# EAGLE design gateway (EAGLE 9.6.2)
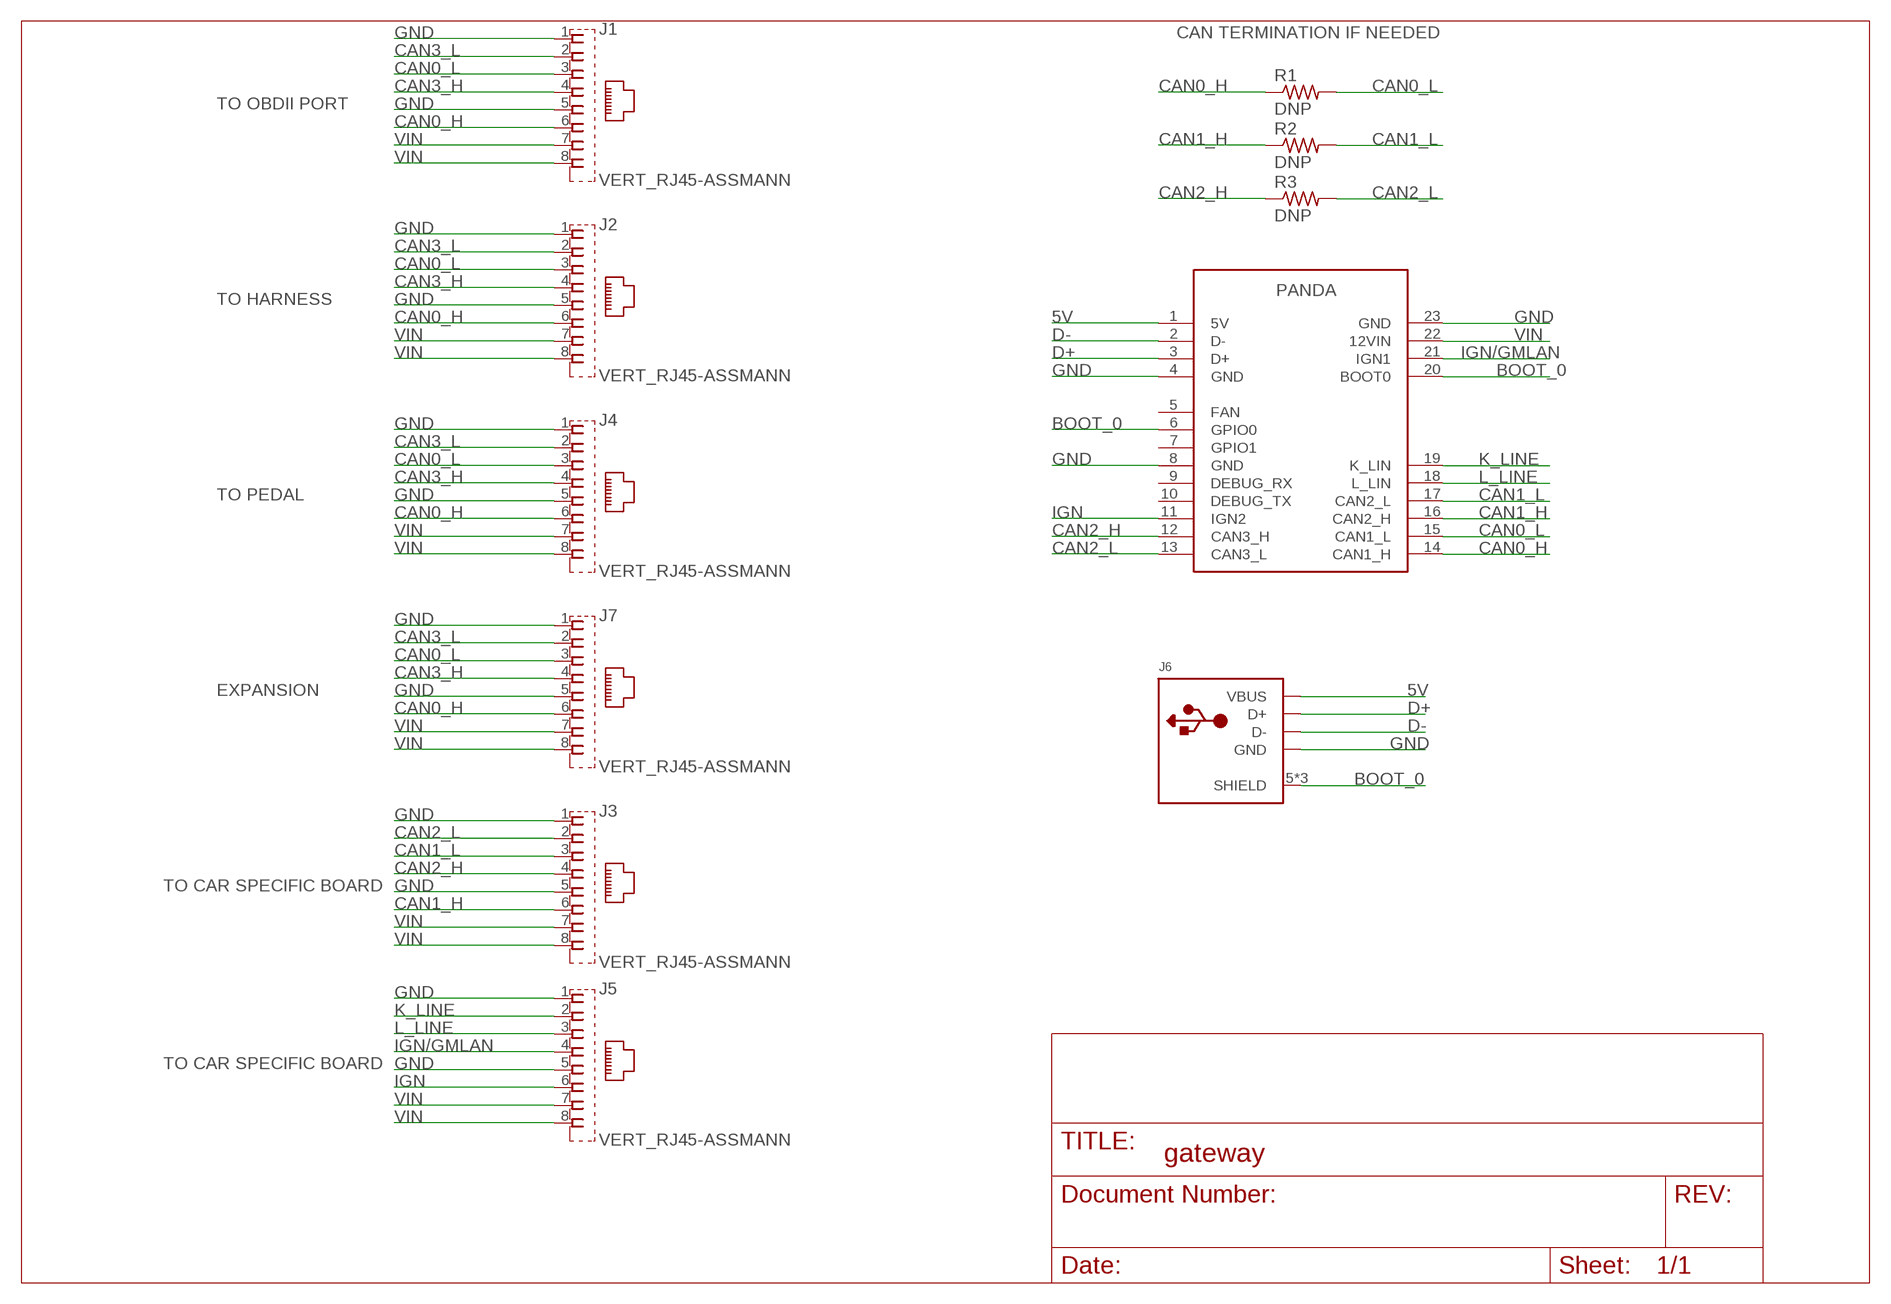
[diagram p0: schematic, sheet 1]

## Parts
J1  VERT_RJ45-ASSMANN  [RJ45-VERT]
J2  VERT_RJ45-ASSMANN  [RJ45-VERT]
J3  VERT_RJ45-ASSMANN  [RJ45-VERT]
J4  VERT_RJ45-ASSMANN  [RJ45-VERT]
J5  VERT_RJ45-ASSMANN  [RJ45-VERT]
J6  USB-AMOLEX  [USB-A-VERT-MOLEX]
J7  VERT_RJ45-ASSMANN  [RJ45-VERT]
R1  DNP  R0603  [0603-R]
R2  DNP  R0603  [0603-R]
R3  DNP  R0603  [0603-R]
U$1  PANDA  [PANDA-FOOT]

## Nets
5V: J6.1(VBUS) U$1.1(5V)
BOOT_0: J6.5(SHIELD) J6.6(SHIELD) J6.7(SHIELD) U$1.6(GPIO0) U$1.20(BOOT0)
CAN0_H: J1.6 J2.6 J4.6 J7.6 R1.1 U$1.14(CAN1_H)
CAN0_L: J1.3 J2.3 J4.3 J7.3 R1.2 U$1.15(CAN1_L)
CAN1_H: J3.6 R2.1 U$1.16(CAN2_H)
CAN1_L: J3.3 R2.2 U$1.17(CAN2_L)
CAN2_H: J3.4 R3.1 U$1.12(CAN3_H)
CAN2_L: J3.2 R3.2 U$1.13(CAN3_L)
CAN3_H: J1.4 J2.4 J4.4 J7.4
CAN3_L: J1.2 J2.2 J4.2 J7.2
D+: J6.3(D+) U$1.3(D+)
D-: J6.2(D-) U$1.2(D-)
GND: J1.1 J1.5 J2.1 J2.5 J3.1 J3.5 J4.1 J4.5 J5.1 J5.5 J6.4(GND) J7.1 J7.5 U$1.4(GND) U$1.8(GND) U$1.23(GND)
IGN: J5.6 U$1.11(IGN2)
IGN/GMLAN: J5.4 U$1.21(IGN1)
K_LINE: J5.2 U$1.19(K_LIN)
L_LINE: J5.3 U$1.18(L_LIN)
VIN: J1.7 J1.8 J2.7 J2.8 J3.7 J3.8 J4.7 J4.8 J5.7 J5.8 J7.7 J7.8 U$1.22(12VIN)
Unconnected: U$1.5(FAN) U$1.7(GPIO1) U$1.9(DEBUG_RX) U$1.10(DEBUG_TX)

## Notes on the sheet
- CAN TERMINATION IF NEEDED
- TO OBDII PORT
- TO HARNESS
- TO PEDAL
- EXPANSION
- TO CAR SPECIFIC BOARD
- TO CAR SPECIFIC BOARD

## Library data of the parts
J1-J5 J7 = comma.ai:VERT_RJ45: Mod. Jack, Right Angle, 8 posiotion, 8 contatcs RJ45 Source: GLX-S-88M.pdf; MPN: A-2004-2-4-LPS-N-R
J6 = comma.ai:USB-A; MPN: 1050570001
R1-R3 = comma.ai:R
U$1 = comma.ai:PANDA

## Board
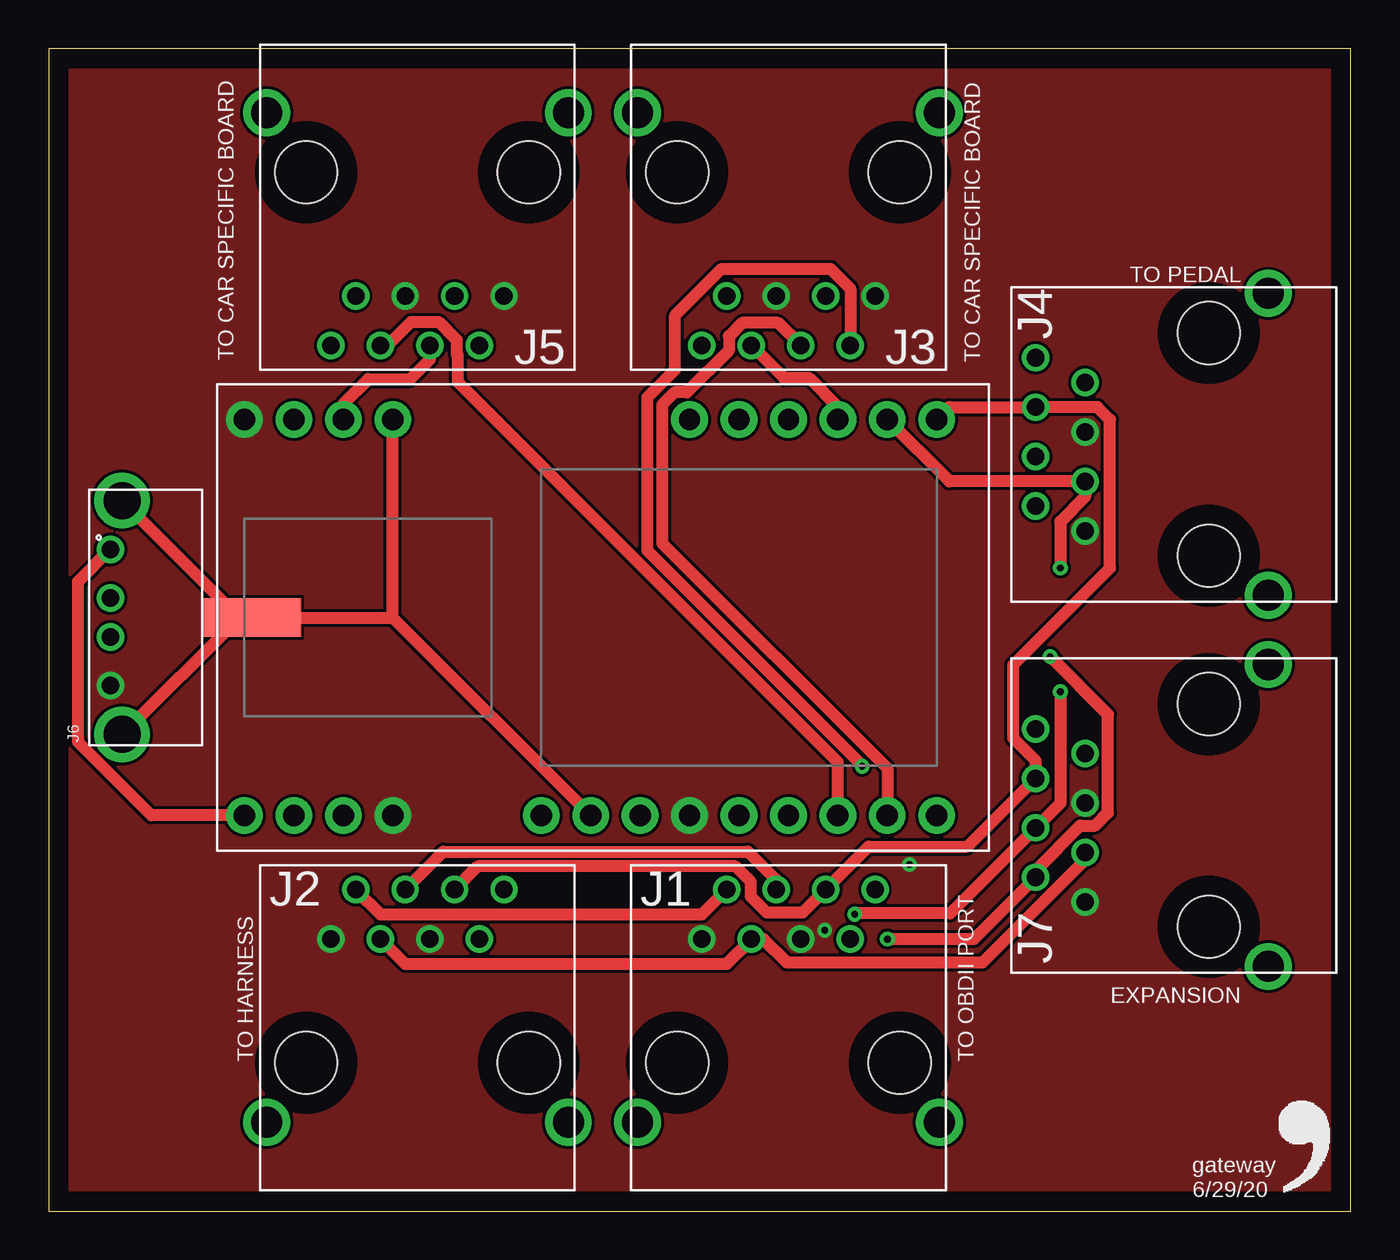
[diagram p1: board, top side]
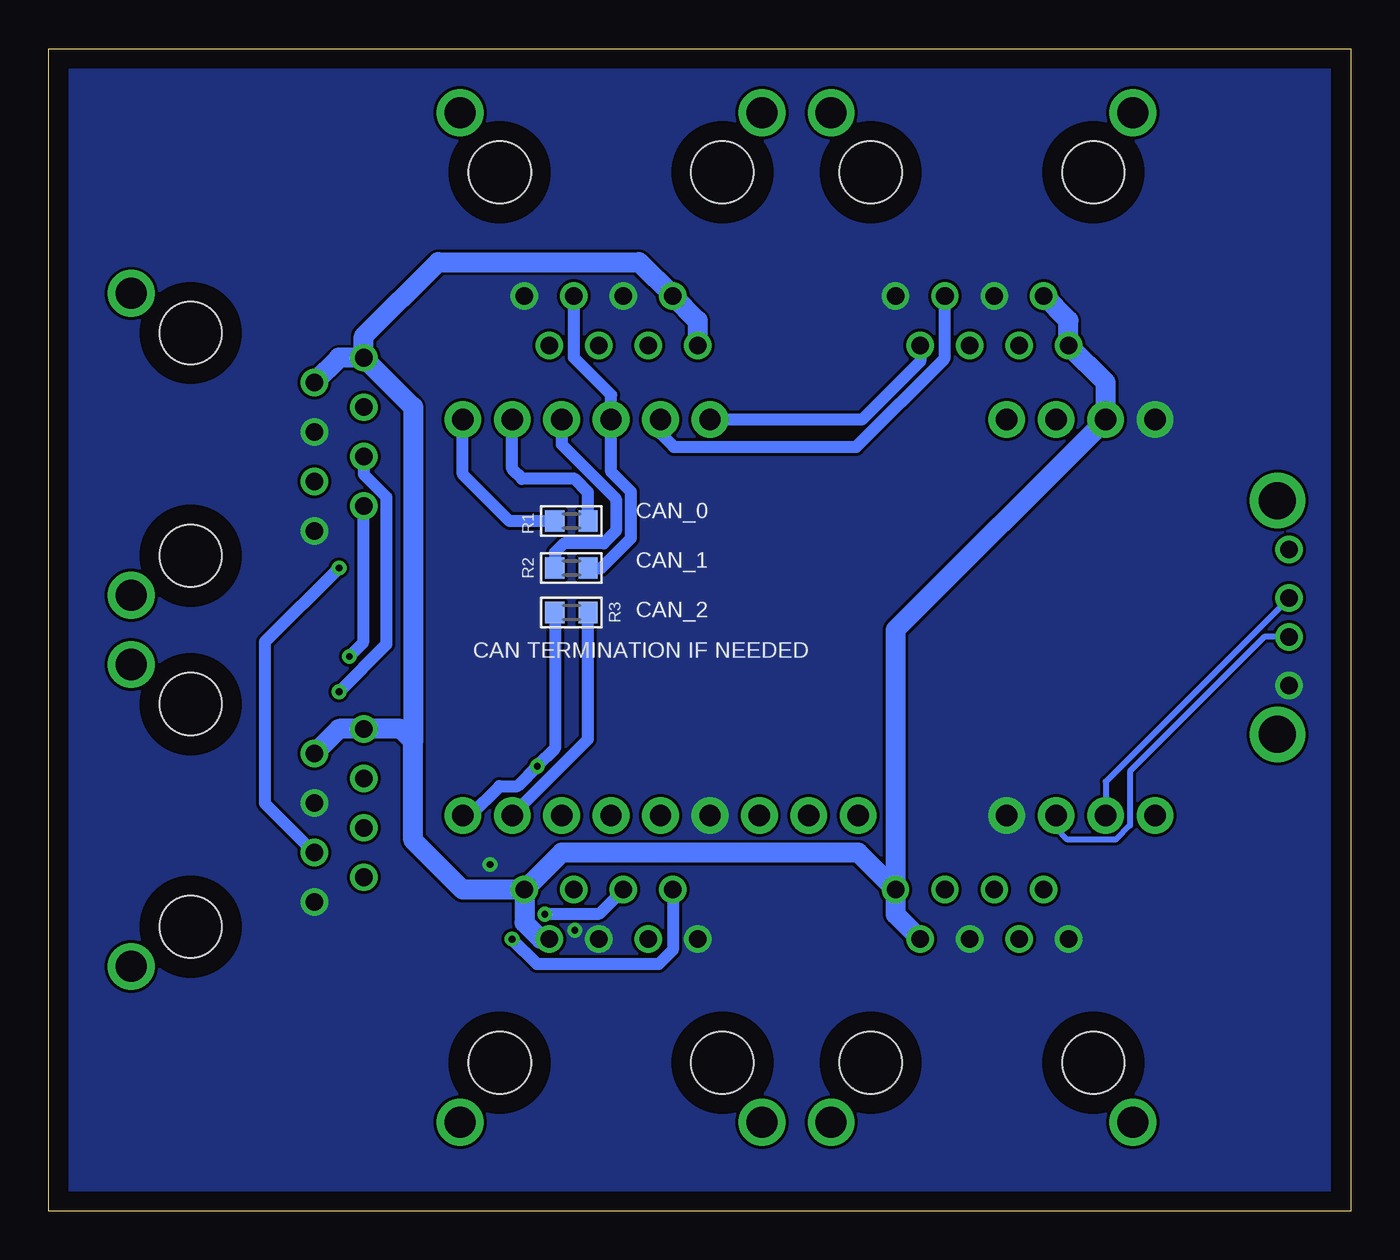
[diagram p2: board, bottom side, seen from below]

Size 66.87 x 59.68 mm. Coordinates in mm from the lower left corner, seen from the top.
Outline: 0,0 66.87,0 66.87,59.68 0,59.68 0,0
Copper layers (1*16): Top 0.035mm / dielectric 1.5mm / Bottom 0.035mm
Design rules "default": minimum track width 6mil, minimum drill 0.35mm, track to track 6mil, track to pad 6mil, pad to pad 6mil, via to via 6mil, smd to smd 6mil, copper to edge 40mil, drill to drill 6mil, minimum pad ring 10mil, minimum via ring 8mil, stop-mask expansion 4mil, vias tented up to drill 0mil, thermal gap 10mil

### Footprints (pad centres in the part's own frame; a part is rotated, then mirrored left to right if it is on the bottom)
RJ45-VERT = drill 0.9: 1 -4.445,6.35; 2 -3.175,8.89; 3 -1.905,6.35; 4 -0.635,8.89; 5 0.635,6.35; 6 1.905,8.89; 7 3.175,6.35; 8 4.445,8.89 | drill 1.6: P$1 -7.75,-3.05; P$2 7.75,-3.05 | hole 3.2: -5.715,0; 5.715,0
USB-A-VERT-MOLEX = drill 0.9 pad 1.3: 1 3.5,1.8; 2 1,1.8; 3 -1,1.8; 4 -3.5,1.8 | drill 1.9 pad 2.4: 5 -6,1.2; 6 6,1.2 | smd 2 x 5: 7 0,-5.5
0603-R = smd 1 x 1.1: 1 -0.85,0; 2 0.85,0
PANDA-FOOT = drill 1.1 pad 1.88: 1 -17.78,-10.16; 2 -15.24,-10.16; 3 -12.7,-10.16; 4 -10.16,-10.16; 5 -2.54,-10.16; 6 0,-10.16; 7 2.54,-10.16; 8 5.08,-10.16; 9 7.62,-10.16; 10 10.16,-10.16; 11 12.7,-10.16; 12 15.24,-10.16; 13 17.78,-10.16; 14 17.78,10.16; 15 15.24,10.16; 16 12.7,10.16; 17 10.16,10.16; 18 7.62,10.16; 19 5.08,10.16; 20 -10.16,10.16; 21 -12.7,10.16; 22 -15.24,10.16; 23 -17.78,10.16

### Placement (x,y rotation side)
J1  37.99,7.62 0 top
J2  18.94,7.62 0 top
J3  37.99,53.34 180 top
J4  59.58,39.37 90 top
J5  18.94,53.34 180 top
J6  4.97,30.48 90 top
J7  59.58,20.32 90 top
R1  40.02,35.43 0 bottom
R2  40.02,33.02 0 bottom
R3  40.02,30.73 180 bottom
U$1  27.83,30.48 0 top
U$2  [LOGO]  62.51,0.68 0 top

### Tracks (layer width: path | path; a pad name or v marks a point on that pad's centre or on a via)
5V
  Top 0.61: J6.1 1.51,32.32 1.51,24.08 5.27,20.32 U$1.1
BOOT_0
  Top 0.61: J6.5 9.77,30.48 | J6.6 9.77,30.48 | 9.77,30.48 9.85,30.4 11.06,30.4 | 17.67,30.48 J6.7 9.77,30.48 | 17.67,30.48 U$1.6 | 17.67,30.48 U$1.20
CAN0_H
  Top 0.61: 45.58,40.64 U$1.14 46.24,41.27 J4.6 53.86,41.27 54.5,40.64 54.5,33.02 49.53,28.05 49.53,24.28 50.69,23.12 J7.6 47.18,18.72 42.1,18.72 J1.6 38.73,15.34 36.87,15.34 36.06,16.15 36.06,16.91 35.27,17.7 22.04,17.7 J2.6
  Bottom 0.61: R1.1 43.2,35.43 45.61,37.85 U$1.14
CAN0_L  (via drill 0.35)
  Top 0.61: U$1.15 46.24,37.46 J4.3 53.23,36.69 51.94,35.41 51.94,33.04 v51.96,33.02 | J2.3 18.3,12.7 34.81,12.7 J1.3 36.72,13.97 37.91,12.78 47.97,12.78 53.23,18.04 J7.3
  Bottom 0.61: R1.2 39.17,36.91 39.85,37.59 42.56,37.59 43.07,38.1 U$1.15 | v51.96,33.02 55.77,29.21 55.77,20.95 J7.3
CAN1_H
  Top 0.61: U$1.16 40.53,41.31 39.09,42.75 37.78,42.75 J3.6
  Bottom 0.61: U$1.16 40.53,39.36 37.74,36.57 37.74,34.92 38.37,34.29 40.4,34.29 40.87,33.82 R2.1
CAN1_L
  Bottom 0.61: R2.2 38.5,33.02 36.97,34.54 36.97,36.95 37.99,37.96 U$1.17 37.99,41.91 39.89,43.82 J3.3
CAN2_H
  Top 0.61: U$1.12 43.07,22.73 31.51,34.3 31.51,41.4 32.15,42.04 32.77,42.04 34.92,44.19 34.92,44.93 35.6,45.61 37.46,45.61 J3.4
  Bottom 0.61: R3.1 39.17,24.22 U$1.12
CAN2_L  (via drill 0.35)
  Top 0.61: v41.78,22.84 41.78,22.88 30.74,33.92 30.74,41.78 32.17,43.2 32.17,45.99 34.56,48.38 40.15,48.38 41.16,47.37 J3.2
  Bottom 0.61: U$1.13 45.23,20.32 43.72,21.83 42.8,21.83 v41.78,22.84 40.87,23.75 R3.2
CAN3_H  (via drill 0.35)
  Top 0.61: J2.4 20.26,18.46 35.91,18.46 37.35,17.02 J1.4 | v41.39,15.25 41.43,15.29 46.29,15.29 J7.4 51.96,20.95 v51.96,26.67
  Bottom 0.61: v41.39,15.25 41.36,15.28 38.59,15.28 J1.4 | J4.4 50.69,37.84 49.53,36.68 49.53,29.1 v51.96,26.67
CAN3_L  (via drill 0.35)
  Top 0.61: J2.2 17.04,15.24 33.55,15.24 J1.2 | v43.07,13.97 47.52,13.97 J7.2 50.69,17.52 52.97,19.79 53.74,19.79 54.4,20.45 54.4,25.51 v51.43,28.48
  Bottom 0.61: v43.07,13.97 41.8,12.7 35.53,12.7 34.81,13.42 J1.2 | v51.43,28.48 51.42,28.48 50.73,29.17 50.73,36.16 J4.2
D+
  Bottom 0.305: J6.3 4.45,29.48 11.34,22.59 11.34,19.8 12.07,19.08 14.56,19.08 15.13,19.65 U$1.3
D-
  Bottom 0.305: J6.2 12.59,22.06 U$1.2
GND  (via drill 0.35)
  other vias: 44.2,17.8 39.85,14.43
  pour Top (no thermals): -1.27,60.96 -1.27,-1.27 68.47,-1.27 68.47,60.96
  pour Bottom (no thermals): 69.74,-2.54 69.74,62.23 -2.54,62.23 -2.54,-2.54
IGN
  Top 0.61: U$1.11 40.51,20.34 40.51,23.07 21,42.58 21,43.92 20.95,43.97 20.95,44.71 20.02,45.65 18.6,45.65 17.4,44.45 J5.6
IGN/GMLAN
  Top 0.61: U$1.21 15.13,41.45 16.4,42.72 18.57,42.72 19.57,43.73 J5.4
K_LINE
  Bottom 0.61: U$1.19 25.11,40.64 22.12,43.63 J5.2
L_LINE
  Bottom 0.61: U$1.18 35.45,39.93 34.76,39.24 25.4,39.24 20.84,43.8 J5.3
VIN
  Bottom 1.016: J2.8 23.38,29.84 U$1.22 12.59,42.55 J5.8 14.5,45.72 J5.7 | J2.8 25.29,18.41 40.53,18.41 J1.8 | J1.8 42.43,14.81 41.59,13.97 J1.7 | J2.8 23.38,15.24 J2.7 | J1.8 45.61,16.51 48.15,19.05 48.15,24.13 | 48.15,24.13 48.78,24.77 J7.8 51.96,24.77 J7.7 | J4.8 51.96,43.82 J4.7 | J4.8 48.15,41.27 48.15,24.13 | J4.8 50.69,44.91 46.87,48.73 36.55,48.73 J3.7 33.55,45.72 J3.8

### Text on the board
tPlace: TO PEDAL | TO CAR SPECIFIC BOARD | TO CAR SPECIFIC BOARD | EXPANSION | TO HARNESS | TO OBDII PORT | gateway | 6/29/20
bPlace: CAN_0 | CAN_1 | CAN_2 | CAN TERMINATION IF NEEDED